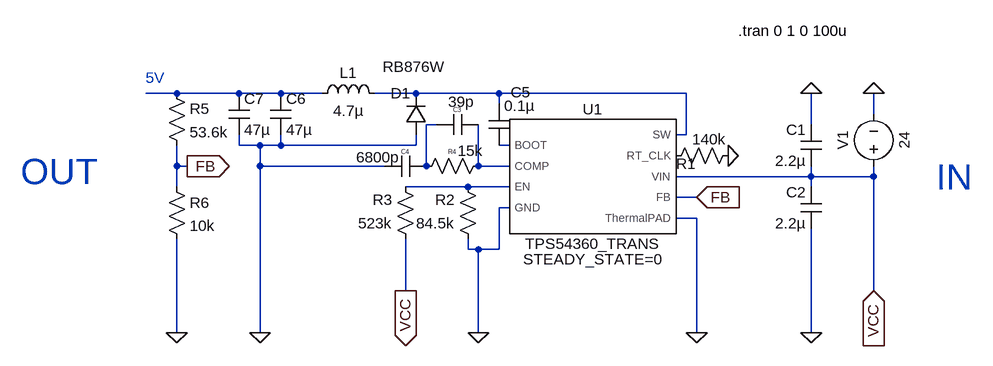
[diagram p0: schematic TPS54360_test_5V.asc]
TPS54360_test_5V.asc, the LTspice schematic file:
Version 4.1
SHEET 1 880 680
WIRE -416 -16 -464 -16
WIRE -320 -16 -416 -16
WIRE -256 -16 -320 -16
WIRE -192 -16 -256 -16
WIRE -48 -16 -112 -16
WIRE 80 -16 -48 -16
WIRE 368 -16 80 -16
WIRE 80 0 80 -16
WIRE 656 16 656 -16
WIRE -16 32 -32 32
WIRE 560 32 560 -16
WIRE 368 48 368 -16
WIRE 368 48 352 48
WIRE -320 64 -320 48
WIRE -288 64 -320 64
WIRE -256 64 -256 48
WIRE -256 64 -288 64
WIRE -48 64 -48 48
WIRE -48 64 -256 64
WIRE 96 64 80 64
WIRE -416 96 -416 64
WIRE -400 96 -416 96
WIRE -288 96 -288 64
WIRE -96 96 -288 96
WIRE -32 96 -32 32
WIRE 48 96 48 32
WIRE 96 96 48 96
WIRE 560 112 560 96
WIRE 560 112 352 112
WIRE 656 112 656 96
WIRE 656 112 560 112
WIRE -416 128 -416 96
WIRE 32 128 -64 128
WIRE 96 128 32 128
WIRE 560 128 560 112
WIRE 384 144 352 144
WIRE 96 160 80 160
WIRE 384 176 352 176
WIRE 32 224 32 208
WIRE 48 224 32 224
WIRE 80 224 80 160
WIRE 80 224 48 224
WIRE -64 288 -64 208
WIRE 656 288 656 112
WIRE -416 352 -416 208
WIRE -288 352 -288 96
WIRE 48 352 48 224
WIRE 384 352 384 176
WIRE 560 352 560 192
FLAG 560 -16 0
FLAG 560 352 0
FLAG 656 -16 0
FLAG 432 80 0
FLAG 48 352 0
FLAG -288 352 0
FLAG 384 144 FB
IOPIN 384 144 In
FLAG -400 96 FB
IOPIN -400 96 Out
FLAG -416 352 0
FLAG 384 352 0
FLAG 656 288 VCC
IOPIN 656 288 In
FLAG -64 288 VCC
IOPIN -64 288 Out
SYMBOL voltage 656 112 R180
WINDOW 0 32 56 VTop 2
WINDOW 3 -32 56 VBottom 2
WINDOW 123 0 0 Left 0
WINDOW 39 -60 56 VBottom 2
SYMATTR InstName V1
SYMATTR Value 24
SYMBOL cap 576 96 R180
WINDOW 0 24 56 Left 2
WINDOW 3 24 8 Left 2
SYMATTR InstName C1
SYMATTR Value 2.2µ
SYMBOL cap 576 192 R180
WINDOW 0 24 56 Left 2
WINDOW 3 24 8 Left 2
SYMATTR InstName C2
SYMATTR Value 2.2µ
SYMBOL res 448 64 R90
WINDOW 0 44 80 VBottom 2
WINDOW 3 -25 45 VTop 2
SYMATTR InstName R1
SYMATTR Value 140k
SYMBOL res 48 224 R180
WINDOW 0 36 76 Left 2
WINDOW 3 36 40 Left 2
SYMATTR InstName R2
SYMATTR Value 84.5k
SYMBOL res -48 224 R180
WINDOW 0 36 76 Left 2
WINDOW 3 36 40 Left 2
SYMATTR InstName R3
SYMATTR Value 523k
SYMBOL cap 64 0 R0
WINDOW 0 34 -18 Left 2
WINDOW 3 24 3 Left 2
SYMATTR InstName C5
SYMATTR Value 0.1µ
SYMBOL ind -208 0 R270
WINDOW 0 32 56 VTop 2
WINDOW 3 5 56 VBottom 2
SYMATTR InstName L1
SYMATTR Value 4.7µ
SYMBOL diode -32 48 R180
WINDOW 0 24 64 Left 2
WINDOW 3 -29 105 Left 2
SYMATTR InstName D1
SYMATTR Value RB876W
SYMBOL cap -272 -16 R0
SYMATTR InstName C6
SYMATTR Value 47µ
SYMBOL cap -336 -16 R0
SYMATTR InstName C7
SYMATTR Value 47µ
SYMBOL TPS54360_TRANS 224 112 R0
SYMATTR InstName U1
SYMBOL res 64 80 R90
WINDOW 0 0 56 VBottom 0
WINDOW 3 -23 28 VTop 2
SYMATTR InstName R4
SYMATTR Value 15k
SYMBOL cap 48 16 R90
WINDOW 0 0 32 VBottom 0
WINDOW 3 -35 26 VTop 2
SYMATTR InstName C3
SYMATTR Value 39p
SYMBOL cap -32 80 R90
WINDOW 0 0 32 VBottom 0
WINDOW 3 -13 74 VTop 2
SYMATTR InstName C4
SYMATTR Value 6800p
SYMBOL res -432 -32 R0
SYMATTR InstName R5
SYMATTR Value 53.6k
SYMBOL res -432 112 R0
SYMATTR InstName R6
SYMATTR Value 10k
TEXT 448 -112 Left 2 !.tran 0 1 0 100u
TEXT -464 -40 Left 2 ;5V
TEXT 752 112 Left 5 ;IN
TEXT -656 104 Left 5 ;OUT

The netlist it stands for:
* TPS54360_test_5V.asc
V1 VCC 0 24
C1 VCC 0 2.2µ
C2 0 VCC 2.2µ
R1 0 P001 140k
R2 0 N006 84.5k
R3 VCC N006 523k
C5 N002 N004 0.1µ
L1 N001 N002 4.7µ
D1 0 N002 RB876W
C6 N001 0 47µ
C7 N001 0 47µ
X§U1 N004 N005 N006 0 N002 P001 VCC FB 0 TPS54360_TRANS STEADY_STATE=0  ; pins BOOT COMP EN GND SW RT_CLK VIN FB ThermalPAD
R4 N005 N003 15k
C3 N005 N003 39p
C4 N003 0 6800p
R5 N001 FB 53.6k
R6 FB 0 10k
.model D D
.lib standard.dio
.tran 0 1 0 100u
* 5V
* IN
* OUT
.lib C:\GitHub\Robotic_Manipulator_HSPS\hardware\simulations\spice_models\dc_dc\TPS54360_PSPICE_TRANS\TPS54360_TRANS.LIB
.backanno
.end